# Altium project ESE516_Shipwars.PrjPcb (part 2 of 2)

## Sheet 5v_BOOST.SchDoc: Shipwars Boost Schematic
size 431 x 279 mm; CheckedBy: SP, PS; Author: SP, PS; CompanyName: UPenn; DrawnBy: SP, PS; Engineer: SP, PS; Organization: UPenn; Address1: 200 S 33rd Street; Address2: Detkin Lab; Address3: Philadelphia; Address4: PA 19104; Revision: .1.0.0; SheetNumber: 6; SheetTotal: 10; Project: Shipwars
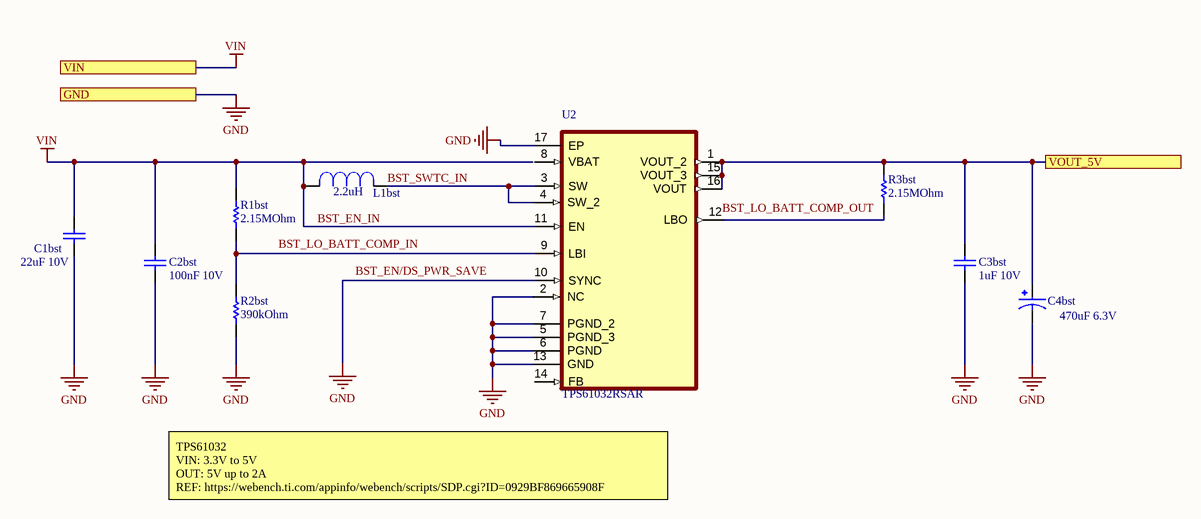
[diagram p5: 5v_BOOST.SchDoc]

### Parts
C1bst  22uF 10V  [CAPC1608X100X20ML10]
C2bst  100nF 10V  [CAPC1005X55X25LL05T10]
C3bst  1uF 10V  [CAPC1608X90X35LL15T15]
C4bst  470uF 6.3V  [6TPB470M]
L1bst  2.2uH  [DR127-2R2-R]
R1bst  2.15MOhm  [RESC1005X40X25LL05T05]
R2bst  390kOhm  [RESC0603(1608)_L]
R3bst  2.15MOhm  [RESC1005X40X25LL05T05]
U2  TPS61032RSAR  [TPS61032RSAR]

### Ports
GND, VIN, VOUT_5V

### Nets
BST_EN_IN: C1bst.2 C2bst.2 L1bst.2 R1bst.2 U2.11(EN) ; port VIN  [also labelled VIN]  [project net VOUT]
GND: C1bst.1 C2bst.1 C3bst.1 C4bst.2 R2bst.1 U2.2(NC) U2.5(PGND_3) U2.6(PGND) U2.7(PGND_2) U2.10(SYNC) U2.13(GND) U2.17(EP) ; port GND
BST_SWTC_IN: L1bst.1 U2.3(SW) U2.4(SW_2)
VOUT_5V: C3bst.2 C4bst.1 R3bst.2 U2.1(VOUT_2) U2.15(VOUT_3) U2.16(VOUT) ; port VOUT_5V
NetR1bst_1: R1bst.1 R2bst.2 U2.9(LBI)
NetR3bst_1: R3bst.1 U2.12(LBO)

Not connected (* = marked no-connect by the designer): U2 8(VBAT) 14(FB)

### Notes on the sheet
- (near U2) TPS61032
  VIN: 3.3V to 5V
  OUT: 5V up to 2A
  REF: https://webench.ti.com/appinfo/webench/scripts/SDP.cgi?ID=0929BF869665908F
- Labels drawn without touching a wire or pin: BST_EN/DS_PWR_SAVE, BST_LO_BATT_COMP_IN, BST_LO_BATT_COMP_OUT
- DWG. NO.
- REV.
- SHT.
- THIS DOCUMENT AND THE DATA DISCLOSED HEREIN OR HEREWITH IS THE PROPERTY OF ALTIUM LIMITED AND MAY BE FREELY DISTRIBUTED IN WHOLE. NO RIGHTS ARE RESERVED OR EXPRESS OR IMPLIED WARANTEE GIVEN.
- REVISION
- DESCRIPTION
- DATE
- APPROVED
- ENG:
- APPROVALS
- PROJECT
- DSN:
- CHK:
- REFERENCE DOCUMENTS
- PROJECT REVISION:
- TITLE
- DOCUMENT REVISION:
- DESIGN ITEM:
- BOM:
- FAB DWG:
- PCB DWG:
- ASSY DWG:
- SCALE:
- SIZE
- B
- CAGE CODE
- FILE NAME
- DWG NO.
- SHEET
- OF
- REV

### Library data of the parts
C1bst = CMP-2000-05441-1: Chip Capacitor, 22 uF, +/- 20%, 10 V, -55 to 85 degC, 0603 (1608 Metric), RoHS, Tape and Reel; Manufacturer: TDK; PCN Part Number: MLCCPartNumberChange30/Nov/2012; Product Training Modules: CSeriesGeneralApplicationsSEAT,CCV,andTVCLDesignToolsGuidetoReplacinganElectrolyticCapacitorwithanMLCC; Other Names: 445-9077-1; Design Resources: 20WNon-IsolatedBuckLEDDriverUsingPLLNK460KG; Online Catalog: CSeries,GeneralPurpose; Capacitance: 22µF; Temperature Coefficient: X5R; Kits: 445-9014-KIT-ND-KITMLCC100PF-22UF060310-50V; Packaging: CutTape(CT); Standard Package: 1; Package / Case: 0603(1608Metric); Lead Style: -; Features: -; Ratings: -; Voltage - Rated: 10V; Operating Temperature: -55degC~85degC; Applications: GeneralPurpose; Package Reference: 603; Datasheet URL: http://download.siliconexpert.com/pdfs/2015/4/21/15/54/45/779/tdk_/manual/37024850441143360mlcc_commercial_general_en.pdf; Datasheet Version: Mar-15; Mounting Type: SurfaceMount,MLCC; Lead Spacing: -; Height - Seated (Max): -; Package Description: 2-Pin Surface Mount Device, Body 1.6 x 0.8 mm; Manufacturer URL: http://www.tdk.com/; RoHS Information: RoHSCertificate-MLCC; Tolerance: ±20%; Series: C; Family: CeramicCapacitors; Category: Capacitors
C2bst = CMP-2000-06331-1: Chip Capacitor, 0.1 uF, +/- 10%, 10 V, -55 to 125 degC, 0402 (1005 Metric), RoHS, Tape and Reel GRM155R71A104KA01D; Manufacturer: Murata; Capacitance: 100000pF; Dielectric: X7R; Rated Voltage: 10V; Manufacturer URL: http://www.murata.com/; Datasheet Version: 02/2016; Datasheet URL: http://search.murata.co.jp/Ceramy/image/img/A01X/G101/ENG/GRM155R71A104KA01-01.pdf; Package Reference: 0402; Tolerance (%): ±10%; Package Description: 2-Pin Surface Mount Device, Body 1 x 0.5 mm; Mounting Technology: SurfaceMount; Case Size/Dimension: 0402
C3bst = CMP-2006-02257-1: 0603(1608) C0603C105K8PACTU; Manufacturer: Kemet; Part Number: C0603C105K8PACTU
C4bst = 6TPB470M: Cap Tant Solid 470uF 6.3V D4 CASE 20% (7.3 X 4.3 X 3.8mm) 2917(7343) SMD 7343 0.035 Ohm 105 C Embossed T/R 6TPB470M; Manufacturer: Panasonic; Material: Polymer; ESR (Equivalent Series Resistance): 35mR; Leakage Current: 296.1uA; Polarity: Polar; Dissipation Factor: 15%; Ripple Current: 3A; Package: None; MP: 6TPB470M; Price: None; Value: *; Availability: Unavailable; Supplier 1: Digi-Key; Supplier Part Number 1: P16619CT-ND; Manufacturer Part Number: 6TPB470M; RoHS: Yes; Category: Tantalum Capacitors; Stock 1: 1296; Pricing 1: 1=2.80000, 10=2.26600, 50=1.97800, 100=1.73070, 500=1.31860, 1000=1.15378 (USD); Mount: Surface Mount; Case/Package: 2917; Number of Pins: 4; Case Code (Imperial): 2917; Case Code (Metric): 7343; Min Operating Temperature: -55°C; Max Operating Temperature: 105°C; Tolerance: 20%; Capacitance: 470uF; Packaging: Tape and Reel; Voltage Rating: 6.3V; Voltage Rating (DC): 6.3V; Termination: SMD/SMT; Package Quantity: 2000; Voltage: 6.3V; Length: 7.3mm; Width: 4.3mm; Height: 3.8mm; Depth: 4.3mm; Height - Seated (Max): 0.157inch; Radiation Hardening: No; REACH SVHC: No SVHC; Lead Free: Lead Free; RoHS Compliant: Yes; ComponentLink1URL: https://datasheet.ciiva.com/48675/aaa8000ce6-48675082.pdf?src-supplier=Avnet; ComponentLink1Description: https://datasheet.ciiva.com/48675/aaa8000ce6-48675082.pdf?src-supplier=Avnet; ComponentLink2URL: https://datasheet.ciiva.com/26840/getdatasheetpartid-747821-26840892.pdf?src-supplier=Verical; ComponentLink2Description: https://datasheet.ciiva.com/26840/getdatasheetpartid-747821-26840892.pdf?src-supplier=Verical; ComponentLink3URL: https://datasheet.ciiva.com/22745/1734361-22745321.pdf?src-supplier=Element14; ComponentLink3Description: https://datasheet.ciiva.com/22745/1734361-22745321.pdf?src-supplier=Element14
L1bst = DR127-2R2-R: Ind Power Shielded Wirewound 2.2uH 20% 100KHz Ferrite 12.5A T/R DR127-2R2-R; Manufacturer: Eaton Cooper; MF: Eaton; Max DC Current: 25.5A; DC Resistance (DCR): 4.02mR; Price: None; SnapEDA_Link: https://www.snapeda.com/parts/DR127-2R2-R/Eaton/view-part/498534/?ref=snap; MP: DR127-2R2-R; Value: *; Mouser-Purchase-URL: https://snapeda.com/shop?store=Mouser&id=498534; Availability: Warning; Package: Nonstandard Coiltronics; DigiKey-Purchase-URL: https://snapeda.com/shop?store=DigiKey&id=498534; Supplier 1: Digi-Key; Supplier Part Number 1: 513-1220-1-ND; Manufacturer Part Number: DR127-2R2-R; RoHS: Yes; Category: Fixed Inductors; Stock 1: 200; Pricing 1: 1=1.50000, 10=1.39400, 25=1.28720, 50=1.07240, 100=1.00820 (USD); Mount: Surface Mount; Case/Package: Nonstandard; Core Material: Ferrite; Weight: 0.208oz; Min Operating Temperature: -40°C; Max Operating Temperature: 125°C; Tolerance: 20%; Inductance: 2.2uH; Inductance Tolerance: 20%; Packaging: Tape and Reel; Shielding: Shielded; Package Quantity: 350; Current Rating: 12.5A; Saturation Current: 25.5A; Resistor Type: Wirewound; Test Frequency: 100kHz; Termination: SMD/SMT; RMS Current (Irms): 12.5A; DC Current: 12.5A; Self Resonant Frequency: 100kHz; Series: DR; Rated Current-Max: 12.5A; Length: 12.5mm; Width: 0.492inch; Height: 8mm; Height - Seated (Max): 0.315inch; Depth: 12.5mm; Radiation Hardening: No; REACH SVHC: No SVHC; Military Standard: Not; Lead Free: Lead Free; ComponentLink1URL: https://datasheet.ciiva.com/14667/0900766b8116a153-14667792.pdf?src-supplier=RSComponents; ComponentLink1Description: https://datasheet.ciiva.com/14667/0900766b8116a153-14667792.pdf?src-supplier=RSComponents; ComponentLink2URL: https://datasheet.ciiva.com/26858/getdatasheetpartid-246998-26858414.pdf?src-supplier=Verical; ComponentLink2Description: https://datasheet.ciiva.com/26858/getdatasheetpartid-246998-26858414.pdf?src-supplier=Verical; ComponentLink3URL: https://datasheet.ciiva.com/30226/43bus-elx-ds-4315-dr-ser-30226599.pdf?src-supplier=Onlinecomponents.com; ComponentLink3Description: https://datasheet.ciiva.com/30226/43bus-elx-ds-4315-dr-ser-30226599.pdf?src-supplier=Onlinecomponents.com; ComponentLink4URL: https://datasheet.ciiva.com/8004/87246-8004873.pdf?src-supplier=Element14; ComponentLink4Description: https://datasheet.ciiva.com/8004/87246-8004873.pdf?src-supplier=Element14; ComponentLink5URL: https://datasheet.ciiva.com/16226/bus-elx-ds-4315-dr-series-16226311.pdf?src-supplier=Future+Electronics; ComponentLink5Description: https://datasheet.ciiva.com/16226/bus-elx-ds-4315-dr-series-16226311.pdf?src-supplier=Future+Electronics; ComponentLink6URL: https://datasheet.ciiva.com/16940/70037876-16940757.pdf?src-supplier=Allied+Electronics; ComponentLink6Description: https://datasheet.ciiva.com/16940/70037876-16940757.pdf?src-supplier=Allied+Electronics
R1bst = CMP-2002-00322-1: 1% 0402(1005)CRCW04022M15FKED; Manufacturer: Vishay Dale; Part Number: CRCW04022M15FKED
R2bst = CMP-1012-00802-1: 390K 0.1W 1% 0603 (1608 Metric)  SMD; Case-EIA: 0603; Case-Metric: 1608; Value: 390000.00 Ohm; Power: 0.1 W; Technology: SMT; Tolerance: 1 %
R3bst = CMP-2002-00322-1: 1% 0402(1005) CRCW04022M15FKED; Manufacturer: Vishay Dale; Part Number: CRCW04022M15FKED
U2 = TPS61032RSAR: 5-V Output, 1-A, 96% Efficient Boost Converter w/20uA Iq in TSSOP-16 16-QFN -40 to 85; Manufacturer: Texas Instruments; Number of Outputs: 1; Output Voltage: 5V; Output Current: 1A; Min Input Voltage: 1.8V; Max Input Voltage: 5.5V; Switching Frequency: 600kHz; Synchronous Rectifier: Yes; Quiescent Current: 20uA; Output Type: Fixed; Output Configuration: Positive; Supplier 1: Digi-Key; Manufacturer Part Number: TPS61032RSAR; RoHS: Yes; Category: Voltage Regulators - Switching; Stock 1: 952; Pricing 1: 1=3.13000, 10=2.80800, 25=2.65440, 100=2.30060, 250=2.18260, 500=1.95844, 1000=1.94775 (USD); Mount: Surface Mount; Case/Package: VQFN; Number of Pins: 16; Weight: 0.001464oz; Min Operating Temperature: -40°C; Max Operating Temperature: 85°C; Efficiency: 96%; Packaging: Tape and Reel; Package Quantity: 1; Max Output Current: 1A; Topology: Boost; Operating Supply Voltage: 5.5V; Series: -; Min Output Voltage: 5V; Nominal Output Voltage: 5V; Width: 4mm; Radiation Hardening: No; Lead Free: Lead Free; RoHS Compliant: Yes; REACH SVHC: No SVHC; ComponentLink1URL: https://datasheet.ciiva.com/15113/getdatasheetpartid-188315-15113727.pdf?src-supplier=Verical; ComponentLink1Description: https://datasheet.ciiva.com/15113/getdatasheetpartid-188315-15113727.pdf?src-supplier=Verical; ComponentLink2URL: https://datasheet.ciiva.com/26896/tps61032rsar-26896598.pdf?src-supplier=IIIC; ComponentLink2Description: https://datasheet.ciiva.com/26896/tps61032rsar-26896598.pdf?src-supplier=IIIC; ComponentLink3URL: https://datasheet.ciiva.com/2026/tps61030-2026189.pdf?src-supplier=Digi-Key; ComponentLink3Description: https://datasheet.ciiva.com/2026/tps61030-2026189.pdf?src-supplier=Digi-Key; ComponentLink4URL: https://datasheet.ciiva.com/2026/tps61030-2026190.pdf?src-supplier=Digi-Key; ComponentLink4Description: https://datasheet.ciiva.com/2026/tps61030-2026190.pdf?src-supplier=Digi-Key; ComponentLink5URL: https://datasheet.ciiva.com/2026/tps61030-2026191.pdf?src-supplier=Digi-Key; ComponentLink5Description: https://datasheet.ciiva.com/2026/tps61030-2026191.pdf?src-supplier=Digi-Key; ComponentLink6URL: https://datasheet.ciiva.com/22684/1902788-22684647.pdf?src-supplier=Element14; ComponentLink6Description: https://datasheet.ciiva.com/22684/1902788-22684647.pdf?src-supplier=Element14

## Sheet 3.3v_BUCK.SchDoc: Shipwars Buck Schematic
size 431 x 279 mm; CheckedBy: SP, PS; Author: SP, PS; CompanyName: UPenn; DrawnBy: SP, PS; Engineer: SP, PS; Organization: UPenn; Address1: 200 S 33rd Street; Address2: Detkin Lab; Address3: Philadelphia; Address4: PA 19104; Revision: .1.0.0; SheetNumber: 7; SheetTotal: 10; Project: Shipwars
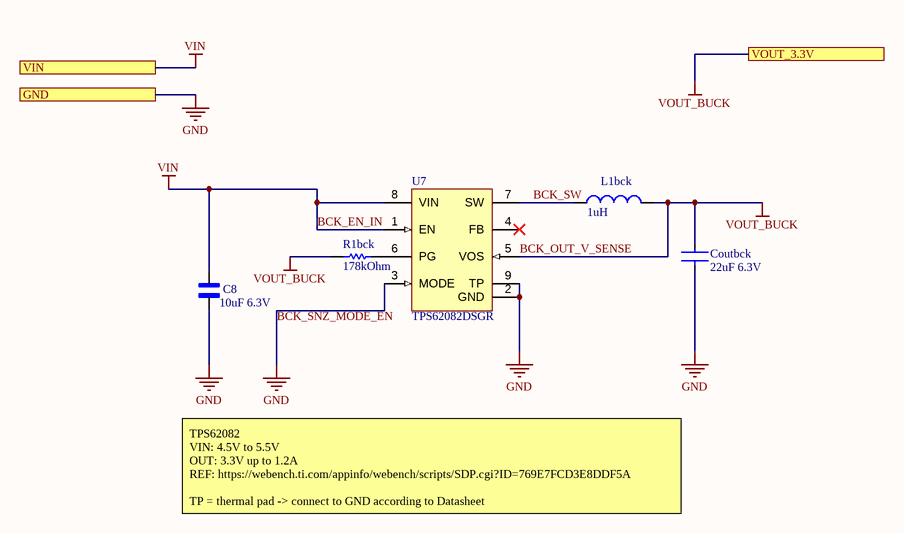
[diagram p6: 3.3v_BUCK.SchDoc]

### Parts
C8  10uF 6.3V  [GRJ155R60J106ME11D]
Coutbck  22uF 6.3V  [FP-GRM188-0_2-IPC_B]
L1bck  1uH  [WE-HCI-7040]
R1bck  178kOhm  [RESC1608X55X25NL10T15]
U7  TPS62082DSGR  [DSG8-1600X900TP]

### Ports
GND, VIN, VOUT_3.3V

### Nets
BCK_EN_IN: C8.2 U7.1(EN) U7.8(VIN) ; port VIN  [also labelled VIN]  [project net 5V]
GND: C8.1 Coutbck.1 U7.2(GND) U7.3(MODE) U7.9(TP) ; port GND  [also labelled BCK_SNZ_MODE_EN]
VOUT_BUCK: Coutbck.2 L1bck.2 R1bck.1 U7.5(VOS) ; port VOUT_3.3V  [also labelled BCK_OUT_V_SENSE]
BCK_SW: L1bck.1 U7.7(SW)
NetR1bck_2: R1bck.2 U7.6(PG)

Not connected (* = marked no-connect by the designer): U7 4(FB)*

### Notes on the sheet
- TPS62082
  VIN: 4.5V to 5.5V
  OUT: 3.3V up to 1.2A
  REF: https://webench.ti.com/appinfo/webench/scripts/SDP.cgi?ID=769E7FCD3E8DDF5A
  TP = thermal pad -> connect to GND according to Datasheet
- DWG. NO.
- REV.
- SHT.
- THIS DOCUMENT AND THE DATA DISCLOSED HEREIN OR HEREWITH IS THE PROPERTY OF ALTIUM LIMITED AND MAY BE FREELY DISTRIBUTED IN WHOLE. NO RIGHTS ARE RESERVED OR EXPRESS OR IMPLIED WARANTEE GIVEN.
- REVISION
- DESCRIPTION
- DATE
- APPROVED
- ENG:
- APPROVALS
- PROJECT
- DSN:
- CHK:
- REFERENCE DOCUMENTS
- PROJECT REVISION:
- TITLE
- DOCUMENT REVISION:
- DESIGN ITEM:
- BOM:
- FAB DWG:
- PCB DWG:
- ASSY DWG:
- SCALE:
- SIZE
- B
- CAGE CODE
- FILE NAME
- DWG NO.
- SHEET
- OF
- REV

### Library data of the parts
C8 = GRJ155R60J106ME11D: Capacitor Ceramic Mlcc 0402 10UF 6.3V SMD; Manufacturer: Murata; Tolerance: 20%; Supplier 1: Digi-Key; Manufacturer Part Number: GRJ155R60J106ME11D; RoHS: Yes; Category: Ceramic Capacitors; Stock 1: 1880133; Pricing 1: 10000=0.03490, 20000=0.03307 (USD); Mount: Surface Mount; Case/Package: 0402; Case Code (Metric): 1005; Case Code (Imperial): 0402; Min Operating Temperature: -55°C; Max Operating Temperature: 85°C; Packaging: Cut Tape; Capacitance: 10uF; Voltage Rating: 6.3V; Features: Soft Termination; Length: 0.039inch; Width: 0.02inch; Thickness: 0.028inch; RoHS Compliant: Yes; ComponentLink1URL: http://psearch.en.murata.com/capacitor/product/GRJ155R60J106ME11%23.pdf?src-supplier=Digi-Key; ComponentLink1Description: http://psearch.en.murata.com/capacitor/product/GRJ155R60J106ME11%23.pdf?src-supplier=Digi-Key
Coutbck = CMP-2006-02797-2: Chip Multilayer Ceramic Capacitors for General Purpose, 0603, 22uF, X5R, 15%, 20%, 6.3V GRM188R60J226MEA0D; Package Quantity: 4000; Case/Package: 0603; Dielectric: X5R; Packaging: Tape and Reel; Mount: Surface Mount; Voltage Rating: 6.3V; Lead Free: Lead Free; Voltage Rating (DC): 6.3V; Depth: 0.8mm; Case Code (Metric): 1608; Case Code (Imperial): 0603; Weight: 0.000222oz; REACH SVHC: No SVHC; Max Operating Temperature: 85°C; Tolerance: 20%; Min Operating Temperature: -55°C; Thickness: 0.039inch; Capacitance: 22uF; Length: 1.6mm; Height: 0.8mm; Termination: SMD/SMT; Width: 0.8mm
L1bck = CMP-0226-00067-1: SMD Flat Wire High Current Inductor WE-HCI, L=1.00 µH 744311100; Inductance: 1.00 ÂµH; PackageReference: WE-HCI-7040; ComponentLink2Description: Datasheet; ComponentLink1Description: Manufacturer Link; PackageVersion: 2008; ComponentLink2URL: http://www.we-online.de/katalog/media/pdf/744311100.pdf; DatasheetVersion: ver 1, Feb-2008; PackageDescription: SMD Inductor, 2-Leads, Body 7.0 x 6.9 mm; ComponentLink1URL: http://www.we-online.com
R1bck = CMP-1012-00762-2: RC0603FR-07178KL; Manufacturer: Yageo; Part Number: RC0603FR-07178KL
U7 = CMP-0323-00344-1: Buck Step Down Regulator with 2.3 to 6 V Input and 3.3 V Output, -40 to 85 degC, 8-Pin WSON (DSG), Green (RoHS & no Sb/Br); Manufacturer: Texas Instruments; Vout(Min)(V): 3.3; Switch Current Limit(Typ)(A): 2.4; SubFamily: Step-Down Regulator; Iout(Max)(A): 1.2; Vin(Min)(V): 2.3; Regulated Outputs(#): 1; Iq(Typ)(mA): 0.006; Rating: Catalog; Duty Cycle(Max)(%): 100; Vin(Max)(V): 6; DatasheetVersion: SLVSAE8B; PackageDescription: 8-Pin Plastic Small Outline No-Lead, 2 x 2 x 0.8 mm Body, 0.5 mm Pitch, Exposed Pad; Eco-Plan: Green (RoHS & no Sb/Br); ComponentLink1URL: http://www.ti.com/general/docs/lit/getliterature.tsp?genericPartNumber=TPS62082&fileType=pdf; ComponentLink2URL: Samples URL:http://www.ti.com/product/tps62082#samples; Topology: Buck; PartNumber: TPS62082DSGR; ComponentLink2Description: URL Link1; Vout(Max)(V): 3.3; Code_JEDEC: MO-229; PackageReference: DSG8-1600X900TP; ComponentLink1Description: Datasheet; Mounting Technology: Surface Mount; PackageVersion: revB, Oct-2010

## Sheet LSM6DSO_ACCELERO.SchDoc: Shipwars Accelero Schematic
size 431 x 279 mm; CheckedBy: SP, PS; Author: SP, PS; CompanyName: UPenn; DrawnBy: SP, PS; Engineer: SP, PS; Organization: UPenn; Address1: 200 S 33rd Street; Address2: Detkin Lab; Address3: Philadelphia; Address4: PA 19104; Revision: .1.0.0; SheetNumber: 9; SheetTotal: 10; Project: Shipwars
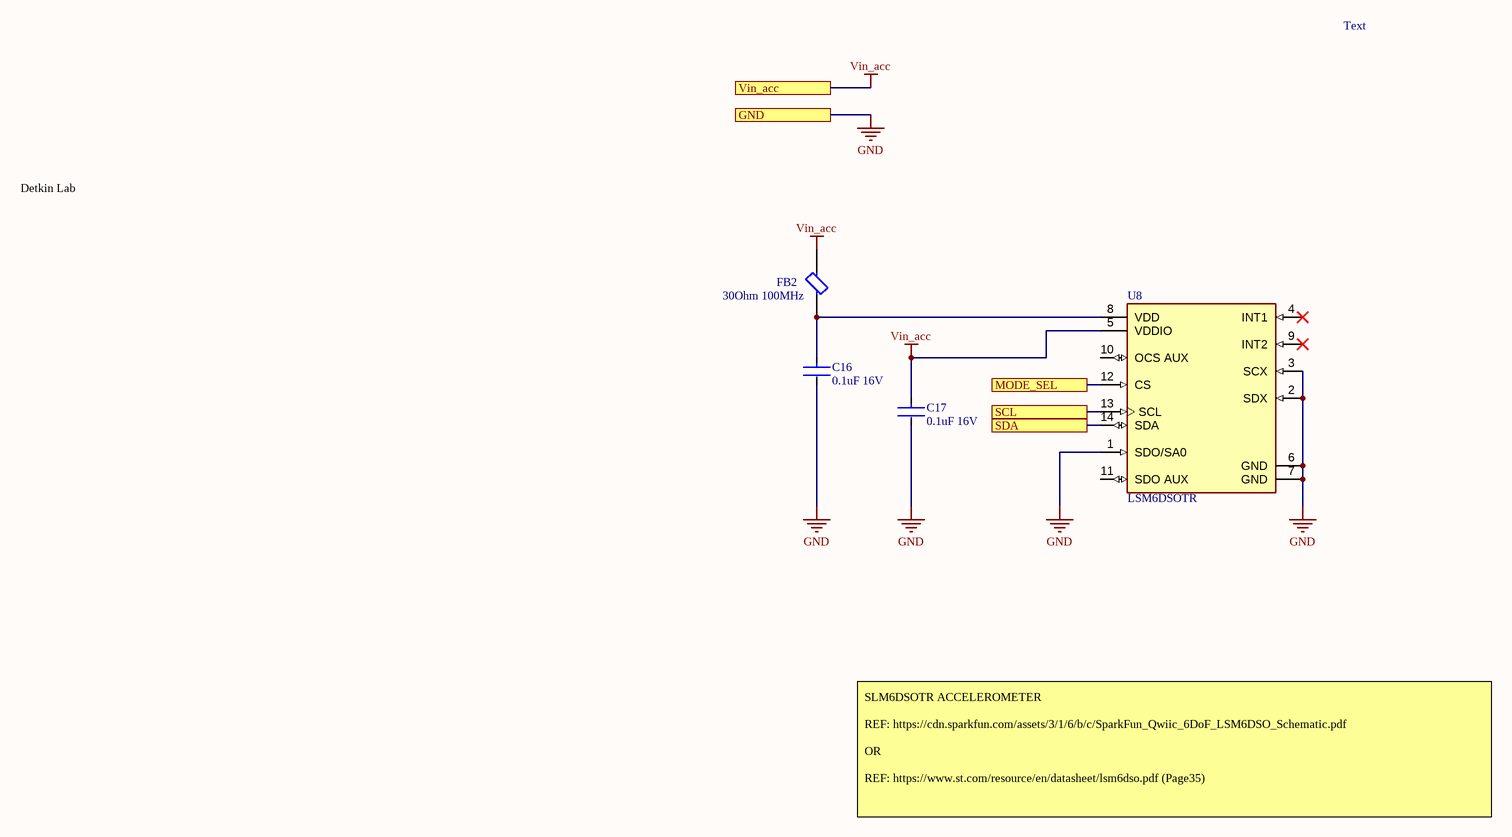
[diagram p7: LSM6DSO_ACCELERO.SchDoc]

### Parts
C16  0.1uF 16V  [FP-CC0402-MFG]
C17  0.1uF 16V  [FP-CC0402-MFG]
FB2  30Ohm 100MHz  [FP-MPZ1608-MFG]
U8  LSM6DSOTR  [FP-LGA-14L-DM00249496-MFG]

### Ports
GND, MODE_SEL, SCL, SDA, Vin_acc

### Nets
GND: C16.2 C17.2 U8.1(SDO/SA0) U8.2(SDX) U8.3(SCX) U8.6(GND) U8.7(GND) ; port GND
Vin_acc: C17.1 FB2.2 U8.5(VDDIO) ; port Vin_acc
ACC_I2C_SCL: U8.13(SCL) ; port SCL
ACC_I2C_SDA: U8.14(SDA) ; port SDA
ACC_MODE_SEL: U8.12(CS) ; port MODE_SEL
NetC16_1: C16.1 FB2.1 U8.8(VDD)

Not connected (* = marked no-connect by the designer): U8 4(INT1)* 9(INT2)* 10(OCS_AUX) 11(SDO_AUX)

### Notes on the sheet
- Text
- Detkin Lab
- SLM6DSOTR ACCELEROMETER
  REF: https://cdn.sparkfun.com/assets/3/1/6/b/c/SparkFun_Qwiic_6DoF_LSM6DSO_Schematic.pdf
  OR
  REF: https://www.st.com/resource/en/datasheet/lsm6dso.pdf (Page35)
- DWG. NO.
- REV.
- SHT.
- THIS DOCUMENT AND THE DATA DISCLOSED HEREIN OR HEREWITH IS THE PROPERTY OF ALTIUM LIMITED AND MAY BE FREELY DISTRIBUTED IN WHOLE. NO RIGHTS ARE RESERVED OR EXPRESS OR IMPLIED WARANTEE GIVEN.
- REVISION
- DESCRIPTION
- DATE
- APPROVED
- ENG:
- APPROVALS
- PROJECT
- DSN:
- CHK:
- REFERENCE DOCUMENTS
- PROJECT REVISION:
- TITLE
- DOCUMENT REVISION:
- DESIGN ITEM:
- BOM:
- FAB DWG:
- PCB DWG:
- ASSY DWG:
- SCALE:
- SIZE
- B
- CAGE CODE
- FILE NAME
- DWG NO.
- SHEET
- OF
- REV

### Library data of the parts
C16 C17 = CMP-03422-000048-1: CAP CER 0.1UF 16V X7R 0402; Manufacturer: YAGEO; Manufacturer Part Number: CC0402KRX7R7BB104; Material: Ceramic; Automotive Grade: NA; Capacitance: 100 nF; Temperature Coefficient: 30ppm/°C; Tolerance: 0.1; Value: 100 nF; Device Class L1: Passive Components; Temperature Range Low: -55°C; Device Class L3: Ceramic Capacitors; Temperature Characteristic: X7R; Ipc Land Pattern Name: CAPC10050X50; Temperature Range High: +125°C; Voltage Rating: 16 V; Temperature: -55°C to +125°C; RoHS: TRUE; Automotive: No; Height: 0.55mm; Device Class L2: Capacitors; Digikey Description: CAP CER 0.1UF 16V X7R 0402; Package: CC0402; Footprint Url: http://www.yageo.com/exep/pages/download/literatures/UPY-C_GEN_24.pdf; ComponentLink2Description: Datasheet; Category: Cap; Lead Free: Yes; Octopart: https://octopart.com/cc0402krx7r7bb104-yageo-42244624; ComponentLink2URL: http://www.yageo.com/documents/recent/UPY-GP_NP0_16V-to-50V_16.pdf; Mouser Description: 0402 0.1 uF 16 V ±10 % Tolerance X7R SMT Multilayer Ceramic Capacitor
FB2 = CMP-08257-000002-1: FERRITE BEAD 30 OHM 0603 1LN; Manufacturer: TDK; Manufacturer Part Number: MPZ1608S300ATAH0; Series Resistance: 0.01Ω; Rms Current: 5A; Tolerance: 10%; Impedance At Frequency: 30Ω @ 100MHz; Category: FBead; Device Class L3: Ferrite Beads and Chips; Device Class L1: Passive Components; Height: 0.75mm; Temperature Range High: +125°C; ComponentLink2Description: Datasheet; Automotive: No; Temperature: -55°C to +125°C; Octopart: https://octopart.com/mpz1608s300atah0-tdk-12062606; Ipc Land Pattern Name: CAPC16080X60; Lead Free: Yes; Device Class L2: EMI / RFI Components; RoHS: TRUE; Temperature Range Low: -55°C; Digikey Description: FERRITE BEAD 30 OHM 0603 1LN; ComponentLink2URL: https://product.tdk.com/info/en/catalog/datasheets/beads_commercial_power_mpz1608_en.pdf; Mouser Description: Ferrite Beads 30ohms 5A 10mOhms 0603 Ferrite Chip; Package: MPZ1608
U8 = CMP-12177-000012-1: INEMO INERTIAL MODULE: 3D ACCELE; Manufacturer: STMicroelectronics; Gyro Range: 125/250/500/1000/2000°/s; Max Supply Voltage: 3.6V; Sensor Output: I2C,SPI; Operating Supply Current: 0.55mA; Accel Range: 2/4/8/16g; Min Supply Voltage: 1.62V; Sensor Type: Temperature,Accelerometer,Gyroscope; Height: 0.86mm; Automotive: No; Device Class L3: Inertial Measurement Units (IMUs); Device Class L1: Sensors; ComponentLink2Description: Datasheet; Device Class L2: Motion Sensors; Temperature: -40°C to +85°C; Package: LGA-14L-DM00249496; Octopart: https://octopart.com/lsm6dsotr-stmicroelectronics-81706672; Temperature Range Low: -40°C; Digikey Description: CONSUMER MEMS; ComponentLink2URL: https://www.st.com/resource/en/datasheet/lsm6dso.pdf; Manufacturer Part Number: LSM6DSOTR; Footprint Url: https://www.st.com/content/ccc/resource/technical/document/technical_note/73/17/9c/16/dd/96/4a/01/CD00134799.pdf/files/CD00134799.pdf/jcr:content/translations/en.CD00134799.pdf; Lead Free: Yes; RoHS: TRUE; Category: IC; Temperature Range High: +85°C

## Sheet Joystick.SchDoc: Shipwars Joystick Schematic
size 431 x 279 mm; CheckedBy: SP, PS; Author: SP, PS; CompanyName: UPenn; DrawnBy: SP, PS; Engineer: SP, PS; Organization: UPenn; Address1: 200 S 33rd Street; Address2: Detkin Lab; Address3: Philadelphia; Address4: PA 19104; Revision: .1.0.0; SheetNumber: 8; SheetTotal: 10; Project: Shipwars
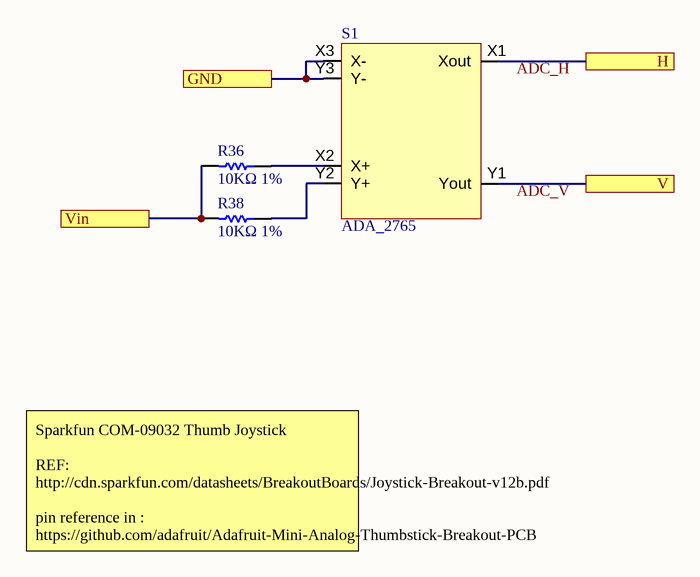
[diagram p8: Joystick.SchDoc]

### Parts
R36  10KΩ 1%  [RESC0603(1608)_N]
R38  10KΩ 1%  [RESC0603(1608)_N]
S1  ADA_2765  [ADA_2765]

### Ports
GND, H, V, Vin

### Nets
GND: S1.X3(X-) S1.Y3(Y-) ; port GND
ADC_1_THUMBSTICK: S1.X1(Xout) ; port H
ADC_2_THUMBSTICK: S1.Y1(Yout) ; port V
Vin: R36.2 R38.2 ; port Vin
NetR36_1: R36.1 S1.X2(X+)
NetR38_1: R38.1 S1.Y2(Y+)

### Notes on the sheet
- Sparkfun COM-09032 Thumb Joystick
  REF: http://cdn.sparkfun.com/datasheets/BreakoutBoards/Joystick-Breakout-v12b.pdf
  pin reference in : https://github.com/adafruit/Adafruit-Mini-Analog-Thumbstick-Breakout-PCB
- Labels drawn without touching a wire or pin: ADC_H, ADC_V
- DWG. NO.
- REV.
- SHT.
- THIS DOCUMENT AND THE DATA DISCLOSED HEREIN OR HEREWITH IS THE PROPERTY OF ALTIUM LIMITED AND MAY BE FREELY DISTRIBUTED IN WHOLE. NO RIGHTS ARE RESERVED OR EXPRESS OR IMPLIED WARANTEE GIVEN.
- REVISION
- DESCRIPTION
- DATE
- APPROVED
- ENG:
- APPROVALS
- PROJECT
- DSN:
- CHK:
- REFERENCE DOCUMENTS
- PROJECT REVISION:
- TITLE
- DOCUMENT REVISION:
- DESIGN ITEM:
- BOM:
- FAB DWG:
- PCB DWG:
- ASSY DWG:
- SCALE:
- SIZE
- B
- CAGE CODE
- FILE NAME
- DWG NO.
- SHEET
- OF
- REV

### Library data of the parts
R36 R38 = CMP-1012-00623-1: 10K 0.1W 1% 0603 (1608 Metric)  SMD; Value: 10000.00 Ohm; Case-EIA: 0603; Case-Metric: 1608; Power: 0.1 W; Tolerance: 1 %; Technology: SMT
S1 = ADA_2765: Mini 2-Axis Analog Thumbstick; Manufacturer: Adafruit Industries; Manufacturer Part Number: 2765; Resistance: 10kR; Supplier 1: Digi-Key; Supplier Part Number 1: 1528-1730-ND; RoHS: Yes; Stock 1: 673; Pricing 1: 1=2.50000 (USD); Mount: Through Hole; Packaging: Bulk; Length: 0.707inch; Width: 0.697inch; Height: 0.472inch; ComponentLink1URL: https://media.digikey.com/pdf/Data%20Sheets/Adafruit%20PDFs/2765_Web.pdf?src-supplier=Digi-Key; ComponentLink1Description: https://media.digikey.com/pdf/Data%20Sheets/Adafruit%20PDFs/2765_Web.pdf?src-supplier=Digi-Key

## Sheet Buzzer.SchDoc: Shipwars Buzzer Schematic
size 431 x 279 mm; CheckedBy: SP, PS; Author: SP, PS; CompanyName: UPenn; DrawnBy: SP, PS; Engineer: SP, PS; Organization: UPenn; Address1: 200 S 33rd Street; Address2: Detkin Lab; Address3: Philadelphia; Address4: PA 19104; Revision: .1.0.0; SheetNumber: 10; SheetTotal: 10; Project: Shipwars
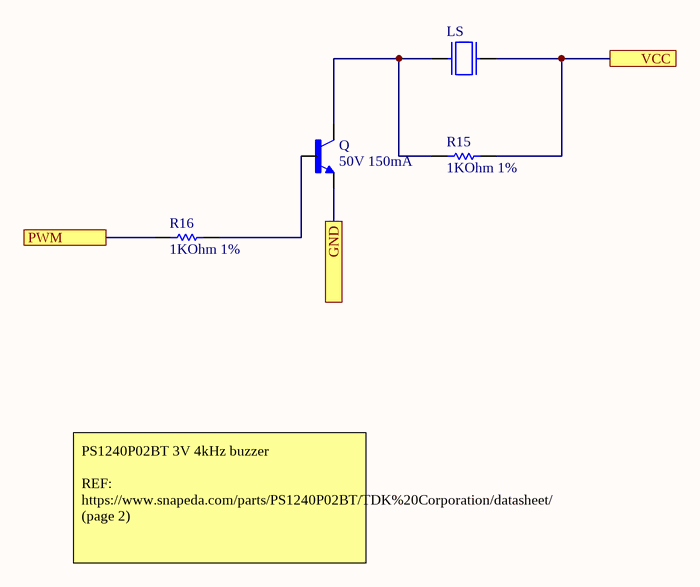
[diagram p9: Buzzer.SchDoc]

### Parts
LS  PS1240P02BT  [PS1240P02BT]  (value not drawn)
Q  50V 150mA  [2SC1815]
R15  1KOhm 1%  [RESC0603(1608)_M]
R16  1KOhm 1%  [RESC0603(1608)_M]

### Ports
GND, PWM, VCC

### Nets
GND: Q.1(E) ; port GND
PWM: R16.1 ; port PWM
VCC: LS.2 R15.2 ; port VCC
NetLS_1: LS.1 Q.2(C) R15.1
NetQ_3: Q.3(B) R16.2

### Notes on the sheet
- PS1240P02BT 3V 4kHz buzzer
  REF: https://www.snapeda.com/parts/PS1240P02BT/TDK%20Corporation/datasheet/ (page 2)
- DWG. NO.
- REV.
- SHT.
- THIS DOCUMENT AND THE DATA DISCLOSED HEREIN OR HEREWITH IS THE PROPERTY OF ALTIUM LIMITED AND MAY BE FREELY DISTRIBUTED IN WHOLE. NO RIGHTS ARE RESERVED OR EXPRESS OR IMPLIED WARANTEE GIVEN.
- REVISION
- DESCRIPTION
- DATE
- APPROVED
- ENG:
- APPROVALS
- PROJECT
- DSN:
- CHK:
- REFERENCE DOCUMENTS
- PROJECT REVISION:
- TITLE
- DOCUMENT REVISION:
- DESIGN ITEM:
- BOM:
- FAB DWG:
- PCB DWG:
- ASSY DWG:
- SCALE:
- SIZE
- B
- CAGE CODE
- FILE NAME
- DWG NO.
- SHEET
- OF
- REV

### Library data of the parts
LS = PS1240P02BT: TDK - PS1240P02BT - BUZZER, PIEZO, 70DB, 12.2MM; Number of Terminals/Pins: 2; Frequency: 4kHz; Operating Supply Voltage: 3V; Washable: No; MP: PS1240P02BT; Availability: Unavailable; Package: 2020 TDK; MF: TDK; Value: *; Price: None; SnapEDA_Link: https://www.snapeda.com/parts/PS1240P02BT/TDK/view-part/53420/?ref=snap; Supplier 1: Digi-Key; Supplier Part Number 1: 445-2525-1-ND; Manufacturer: TDK; Manufacturer Part Number: PS1240P02BT; RoHS: Yes; Category: Audio Products; Stock 1: 31933; Pricing 1: 1=0.61000, 10=0.52500, 25=0.49120, 50=0.46580, 100=0.44110 (USD); Mount: Through Hole; Number of Pins: 2; Min Operating Temperature: -10°C; Max Operating Temperature: 70°C; Termination: PC Pins; Package Quantity: 1; Packaging: Tape and Reel; Voltage Rating (DC): 3V; Series: PS; Diameter: 12.2mm; Height: 6.5mm; Lead Free: Lead Free; RoHS Compliant: Yes; ComponentLink1URL: https://datasheet.ciiva.com/0/ef532-ps-112.pdf?src-supplier=Digi-Key; ComponentLink1Description: https://datasheet.ciiva.com/0/ef532-ps-112.pdf?src-supplier=Digi-Key; ComponentLink2URL: https://datasheet.ciiva.com/0/ef532-ps-111.pdf?src-supplier=Digi-Key; ComponentLink2Description: https://datasheet.ciiva.com/0/ef532-ps-111.pdf?src-supplier=Digi-Key; ComponentLink3URL: https://datasheet.ciiva.com/3306/ef532-ps-3306958.pdf?src-supplier=Avnet; ComponentLink3Description: https://datasheet.ciiva.com/3306/ef532-ps-3306958.pdf?src-supplier=Avnet; ComponentLink4URL: https://datasheet.ciiva.com/16225/ef532-ps-16225062.pdf?src-supplier=Onlinecomponents.com; ComponentLink4Description: https://datasheet.ciiva.com/16225/ef532-ps-16225062.pdf?src-supplier=Onlinecomponents.com
Q = 2SC1815: Transistor GP BJT NPN 50V 150mA 3-Pin TO-92 Box 2SC1815; Manufacturer Part Number: 2SC1815 PBFREE; MF: Central Semiconductor; Package: - Central Semiconductor; Availability: Unavailable; MP: 2SC1815; Value: *; SnapEDA_Link: https://www.snapeda.com/parts/2SC1815/Central%20Semiconductor/view-part/4614189/?ref=snap; Price: None; Supplier 1: Digi-Key; Supplier Part Number 1: 1514-2SC1815PBFREE-ND; Manufacturer: Central Semiconductor; RoHS: Yes; Stock 1: 8551; Pricing 1: 1=0.98000, 10=0.87700, 100=0.68340, 500=0.56458, 1000=0.44572, 2000=0.42050 (USD); RoHS Compliant: Yes
R15 R16 = CMP-1012-00510-1: 1K 0.1W 1% 0603 (1608 Metric)  SMD; Case-Metric: 1608; Case-EIA: 0603; Value: 1000.00 Ohm; Technology: SMT; Tolerance: 1 %; Power: 0.1 W

## Nets that join several sheets
3V3: MAIN (14 pins), MCU (7 pins), Memory (5 pins)
5V: MAIN (R22.2 R27.2 TP20.1), 3.3v_BUCK (C8.2 U7.1 U7.8)
GND: MAIN (15 pins), FTDI (10 pins), MCU (19 pins), Memory (5 pins), LiPo_Charger (11 pins), 5v_BOOST (12 pins), 3.3v_BUCK (5 pins), LSM6DSO_ACCELERO (7 pins), Joystick (S1.X3 S1.Y3), Buzzer (Q.1)
VBAT: MAIN (P1.3), LiPo_Charger (C26.1 U6.2 U6.3)
VBUS: MAIN (J1.1), FTDI (C2.2 D1.4 FB1.1)
Vin_acc: MAIN (R28.1), LSM6DSO_ACCELERO (C17.1 FB2.2 U8.5)
VOUT: MAIN (R23.2), 5v_BOOST (5 pins)
Vout_BQ: MAIN (R23.1), LiPo_Charger (6 pins)
VOUT_BUCK: MAIN (R25.1), 3.3v_BUCK (Coutbck.2 L1bck.2 R1bck.1 U7.5)
VUSB: MAIN (TP1.1), FTDI (6 pins), LiPo_Charger (C24.2 U6.13)
ACC_I2C_SCL: MAIN (R29.1 TP19.1), MCU (U4.39), LSM6DSO_ACCELERO (U8.13)
ACC_I2C_SDA: MAIN (R30.1 TP21.1), MCU (U4.38), LSM6DSO_ACCELERO (U8.14)
ACC_MODE_SEL: MAIN (R34.2), MCU (U4.27), LSM6DSO_ACCELERO (U8.12)
ADC_1_THUMBSTICK: MCU (U4.35), Joystick (S1.X1)
ADC_2_THUMBSTICK: MCU (U4.34), Joystick (S1.Y1)
BQ_BAT_TS: MAIN (R6.1 TP5.1), LiPo_Charger (U6.1)
FLASH_MEM_SPI_SS: MCU (U4.37), Memory (R13.1 SD1.2 TP11.1)
KEYPAD_I2C_SCL: MAIN (J3.2 R17.1 TP17.1), MCU (U4.9)
KEYPAD_I2C_SDA: MAIN (J3.1 R26.1 TP18.1), MCU (U4.15)
MCU_LED: MAIN (DS1.2), MCU (U4.16)
MCU_RX_UART_CLI: MAIN (TP4.1), FTDI (U1.10), MCU (U4.44)
MCU_TX_UART_CLI: MAIN (TP2.1), FTDI (U1.7), MCU (U4.43)
MEM_SPI_CLK: MAIN (R10.2), Memory (SD1.5 TP10.1)
MEM_SPI_MISO: MAIN (R8.2), Memory (SD1.7 TP9.1)
MEM_SPI_MOSI: MAIN (R9.2), Memory (SD1.3 TP8.1)
ON/OFF_BUTTON: MAIN (C18.2 R32.1 R35.2), MCU (U4.36)
PWM: MCU (U4.18), Buzzer (R16.1)
SERCOM1_PAD2_SPI_MISO: MAIN (R9.1), MCU (U4.8)
SERCOM1_PAD2_SPI_MOSI: MAIN (R8.1), MCU (U4.11)
SERCOM1_PAD3_SPI_SCK: MAIN (R10.1), MCU (U4.12)
SPARE_1: MAIN (J4.1), MCU (U4.19)
SPARE_2: MAIN (J4.2), MCU (U4.22)
SPARE_3: MAIN (J4.3), MCU (U4.28)
STATUS_LED: MAIN (DS3.2), MCU (U4.33)
USB_DATA_N: MAIN (J1.2), FTDI (C5.2 D1.3 R1.1)
USB_DATA_P: MAIN (J1.3), FTDI (C6.2 D1.2 R2.1)
VCC: MAIN (R31.1), Buzzer (LS.2 R15.2)
Vin: MAIN (R33.1), Joystick (R36.2 R38.2)
VOUT_5V: MAIN (R22.1), 5v_BOOST (6 pins)
WIFI_STATUS_LED: MAIN (DS2.2), MCU (U4.31)

## Assembly variants
Build_Alt: not fitted FD1 FD2 FD3 TP1 TP2 TP3 TP4 TP5 TP6 TP7 TP8 TP9 TP10 TP11 TP12 TP13 TP14 TP15 TP16 TP17 TP19 TP20 TP21 TP22 TP23